# EAGLE design obimon_0.2 (EAGLE 8.3.2)
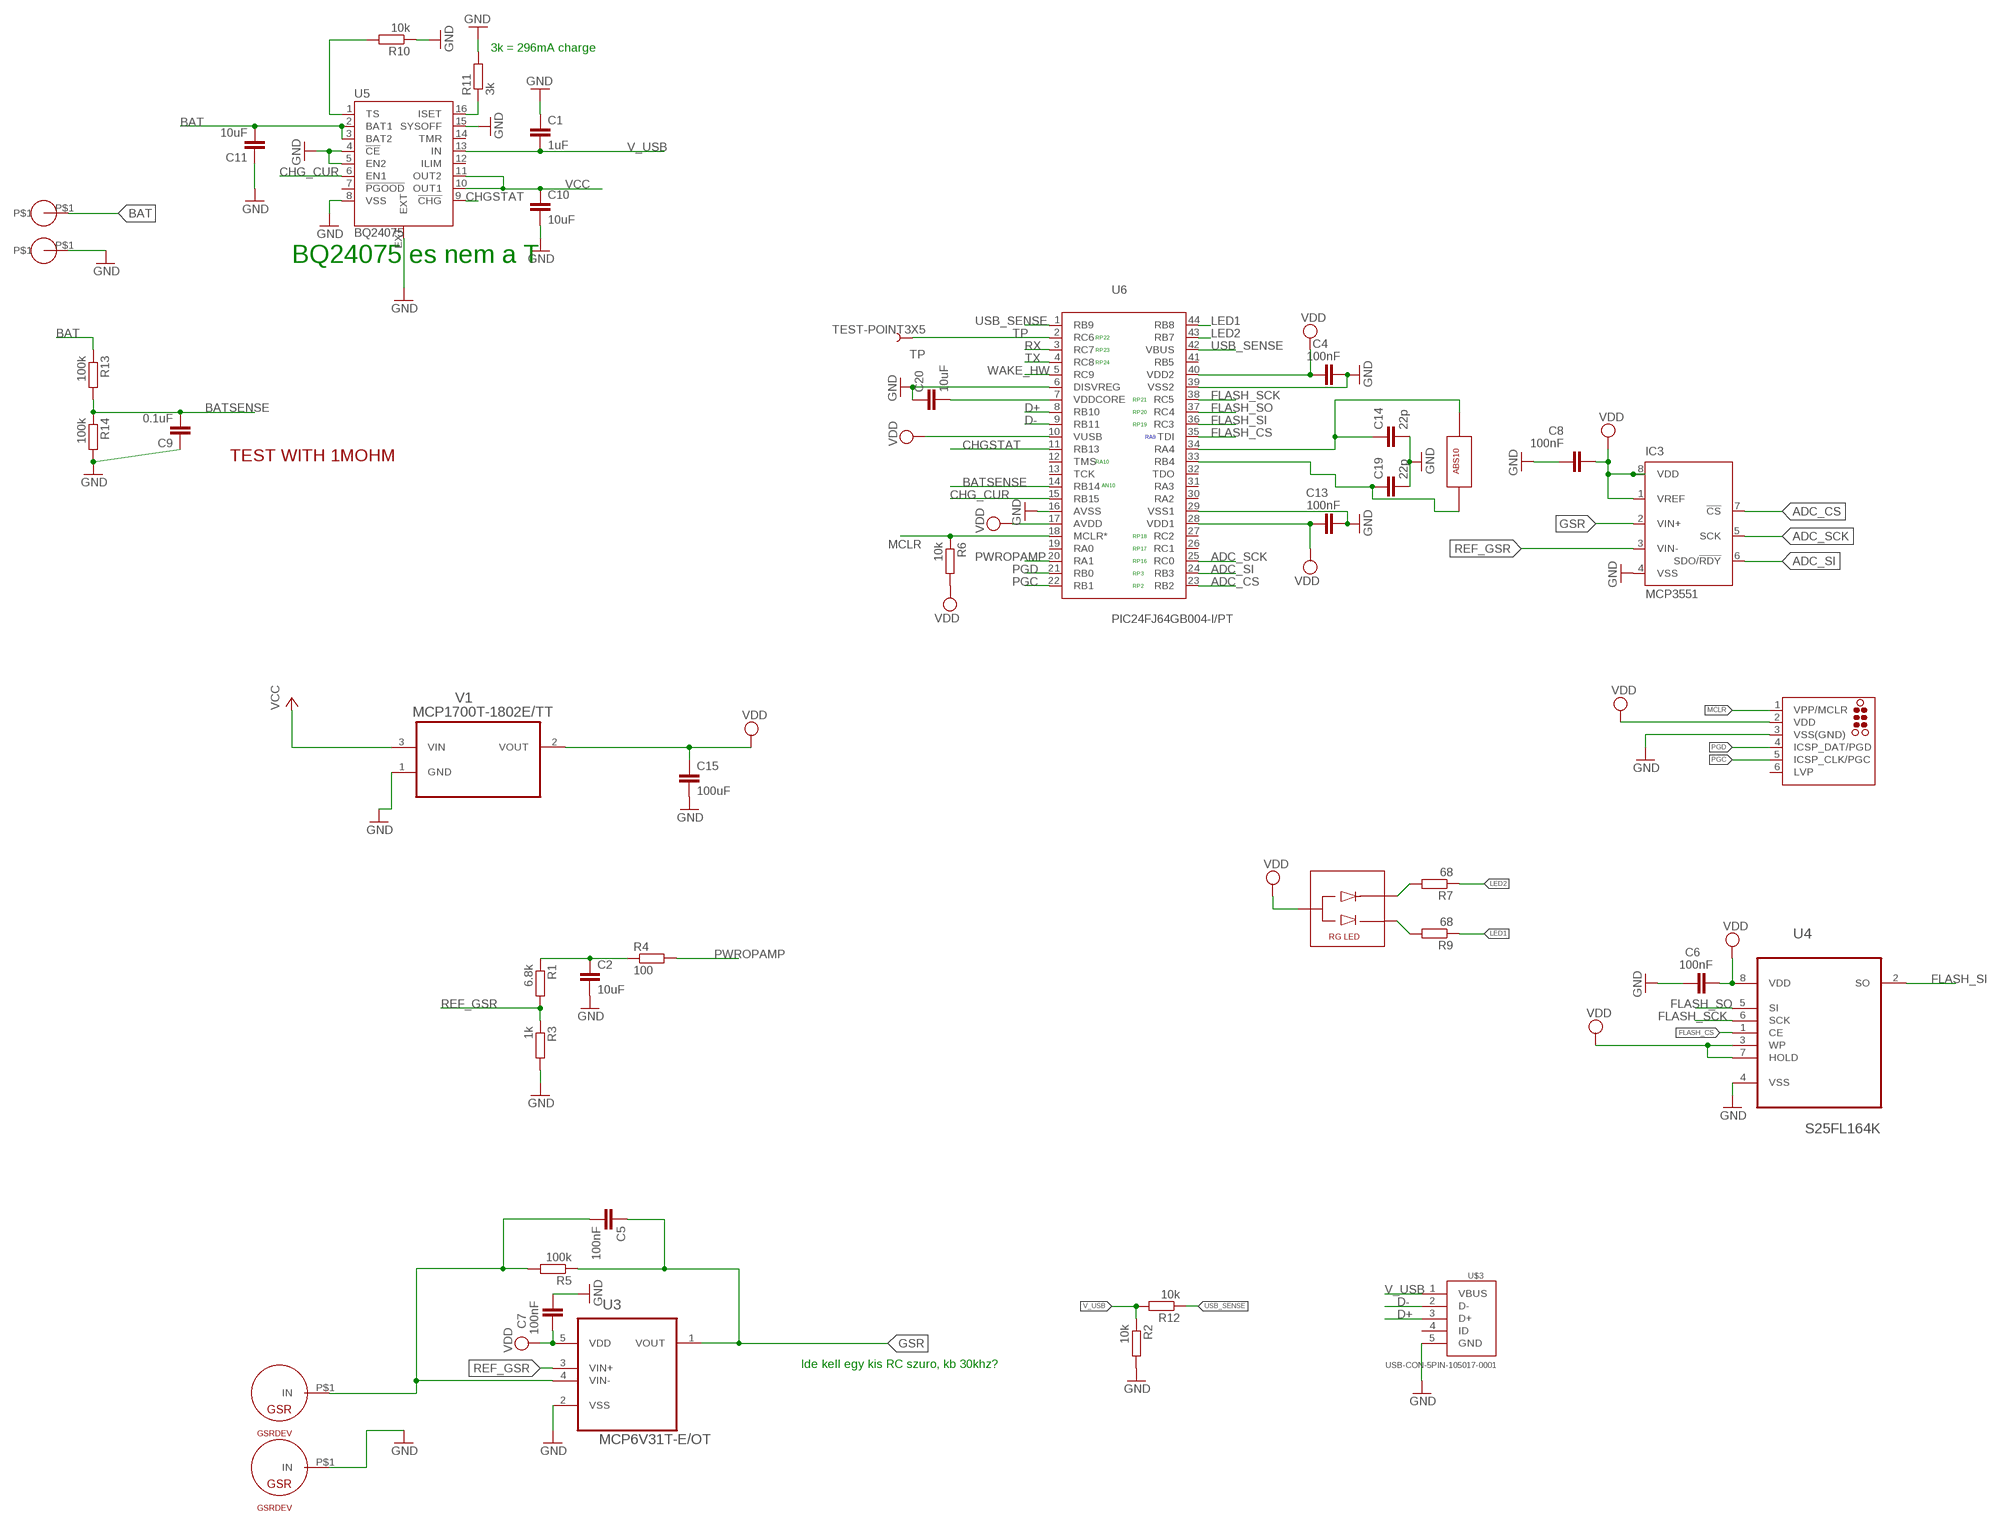
[diagram p0: schematic, sheet 1, part 1 of 2]
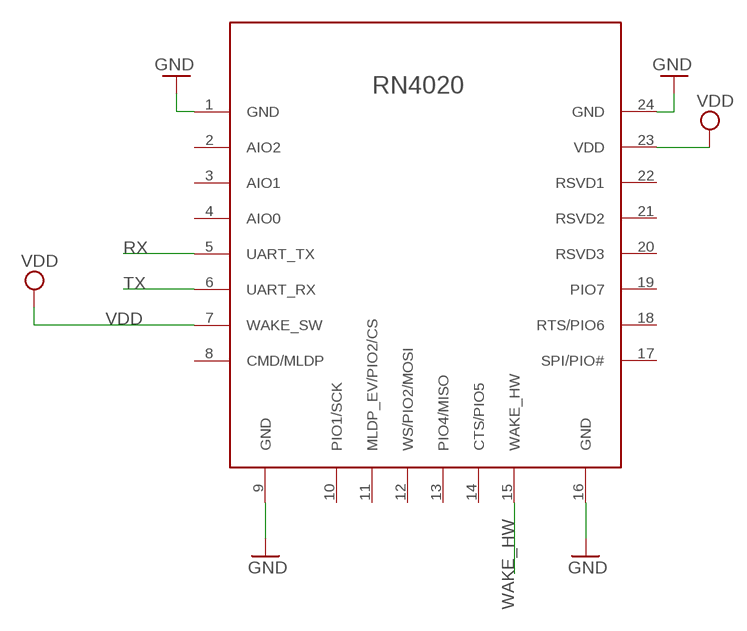
[diagram p1: schematic, sheet 1, part 2 of 2]

## Parts
C1  1uF  C-EUC0805  [C0805]
C2  10uF  C-EUC0805  [C0805]
C4  100nF  C-EUC0805  [C0805]
C5  100nF  C-EUC0805  [C0805]
C6  100nF  C-EUC0805  [C0805]
C7  100nF  C-EUC0805  [C0805]
C8  100nF  C-EUC0805  [C0805]
C9  0.1uF  C-EUC0805  [C0805]
C10  10uF  C-EUC0805  [C0805]
C11  10uF  C-EUC0805  [C0805]
C13  100nF  C-EUC0805  [C0805]
C14  22p  C-EUC0805  [C0805]
C15  100uF  CAP1206  [1206]
C19  22p  C-EUC0805  [C0805]
C20  10uF  C-EUC0805  [C0805]
IC3  MCP3551  MCP3551SN  [SO-08]
J1  TC2030-MCP-NL  [TC2030-MCP-NL]
LED  LED  REDGREENLED  [REDGREENLED]
Q1  ABS10  [ABS10]
R1  6.8k  R-EU_R0805  [R0805]
R2  10k  R-EU_R0805  [R0805]
R3  1k  R-EU_R0805  [R0805]
R4  100  R-EU_R0805  [R0805]
R5  100k  R-EU_R0805  [R0805]
R6  10k  R-EU_M0805  [M0805]
R7  68  R-EU_R0805  [R0805]
R9  68  R-EU_R0805  [R0805]
R10  10k  R-EU_R0805  [R0805]
R11  3k  R-EU_R0805  [R0805]
R12  10k  R-EU_R0805  [R0805]
R13  100k  R-EU_R0805  [R0805]
R14  100k  R-EU_R0805  [R0805]
TP  TEST-POINT3X5  [PAD.03X.05]
U3  MCP6V31T-E/OT  [SOT95P290X145-5N]
U4  S25FL164K  [SOIC127P790X216-8N]
U5  BQ24075  [QFN16_3MM]
U6  PIC24FJ64GB004-I/PT  [QFP80P1200X1200X120-44N]
U$1  GSRDEV  [GSRPAD]
U$2  GSRDEV  [GSRPAD]
U$3  USB-CON-5PIN-105017-0001  [USB-MICRO-MOLEX-105017-0001]
U$6  BATPAD  [BATPAD]
U$7  BATPAD  [BATPAD]
U$8  RN4020  [RN4020]
V1  MCP1700T-1802E/TT  [SOT95P237X112-3N]

## Nets
ADC_CS: IC3.7(!CS) U6.23(RB2)
ADC_SCK: IC3.5(SCK) U6.25(RC0)
ADC_SI: IC3.6(SDO/!RDY) U6.24(RB3)
BAT: C11.2 R13.1 U5.2(BAT1) U5.3(BAT2) U$6.P$1
BATSENSE: C9.2 R13.2 R14.1 U6.14(RB14)
CHG_CUR: U5.6(EN1) U6.15(RB15)
CHGSTAT: U5.9(!CHG) U6.11(RB13)
D+: U6.8(RB10) U$3.3(D+)
D-: U6.9(RB11) U$3.2(D-)
FLASH_CS: U4.1(CE) U6.35(TDI)
FLASH_SCK: U4.6(SCK) U6.38(RC5)
FLASH_SI: U4.2(SO) U6.36(RC3)
FLASH_SO: U4.5(SI) U6.37(RC4)
GND [GND]: C1.1 C2.2 C4.2 C6.1 C7.2 C8.1 C9.1 C10.2 C11.1 C13.2 C14.2 C15.2 C19.2 C20.1 IC3.4(VSS) J1.3(VSS(GND)) R2.2 R3.2 R10.1 R11.2 R14.2 U3.2(VSS) U4.4(VSS) U5.4(!CE) U5.5(EN2) U5.8(VSS) U5.15(SYSOFF) U5.EXT U6.6(DISVREG) U6.16(AVSS) U6.29(VSS1) U6.39(VSS2) U$2.P$1(IN) U$3.5(GND) U$7.P$1 U$8.1(GND) U$8.9(GND) U$8.16(GND) U$8.24(GND) V1.1(GND)
GSR: C5.1 IC3.2(VIN+) R5.1 U3.1(VOUT)
LED1: R9.1 U6.44(RB8)
LED2: R7.1 U6.43(RB7)
MCLR: J1.1(VPP/MCLR) R6.1 U6.18(MCLR*)
N$1: R10.2 U5.1(TS)
N$2: LED.P$3 R7.2
N$3: LED.P$1 R9.2
N$4: R11.1 U5.16(ISET)
N$5: C19.1 Q1.P$1 U6.33(RB4)
N$7: C2.1 R1.1 R4.1
N$10: C5.2 R5.2 U3.4(VIN-) U$1.P$1(IN)
N$11: C14.1 Q1.P$2 U6.34(RA4)
N$17: C20.2 U6.7(VDDCORE)
PGC: J1.5(ICSP_CLK/PGC) U6.22(RB1)
PGD: J1.4(ICSP_DAT/PGD) U6.21(RB0)
PWROPAMP [POWER]: R4.2 U6.20(RA1)
REF_GSR: IC3.3(VIN-) R1.2 R3.1 U3.3(VIN+)
RX: U6.3(RC7) U$8.5(UART_TX)
TP: TP.P$1 U6.2(RC6)
TX: U6.4(RC8) U$8.6(UART_RX)
USB_SENSE: R12.1 U6.1(RB9) U6.42(VBUS)
V_USB [POWER]: C1.2 R2.1 R12.2 U5.13(IN) U$3.1(VBUS)
VCC [POWER]: C10.1 U5.10(OUT1) U5.11(OUT2) V1.3(VIN)
VDD: C4.1 C6.2 C7.1 C8.2 C13.1 C15.1 IC3.1(VREF) IC3.8(VDD) J1.2(VDD) LED.P$2 R6.2 U3.5(VDD) U4.3(WP) U4.7(HOLD) U4.8(VDD) U6.10(VUSB) U6.17(AVDD) U6.28(VDD1) U6.40(VDD2) U$8.7(WAKE_SW) U$8.23(VDD) V1.2(VOUT)
WAKE_HW: U6.5(RC9) U$8.15(WAKE_HW)
Unconnected: J1.6(LVP) U5.7(!PGOOD) U5.12(ILIM) U5.14(TMR) U6.12(TMS) U6.13(TCK) U6.19(RA0) U6.26(RC1) U6.27(RC2) U6.30(RA2) U6.31(RA3) U6.32(TDO) U6.41(RB5) U$3.4(ID) U$8.2(AIO2) U$8.3(AIO1) U$8.4(AIO0) U$8.8(CMD/MLDP) U$8.10(PIO1/SCK) U$8.11(MLDP_EV/PIO2/CS) U$8.12(WS/PIO2/MOSI) U$8.13(PIO4/MISO) U$8.14(CTS/PIO5) U$8.17(SPI/PIO#) U$8.18(RTS/PIO6) U$8.19(PIO7) U$8.20(RSVD3) U$8.21(RSVD2) U$8.22(RSVD1)

## Notes on the sheet
- 3k = 296mA charge
- BQ24075 es nem a T
- RP22
- RP23
- RP24
- RP21
- RP20
- RP19
- RA9
- TEST WITH 1MOHM
- RA10
- AN10
- RP18
- RP17
- RP16
- RP3
- RP2
- Ide kell egy kis RC szuro, kb 30khz?

## Library data of the parts
C1 C2 C4-C11 C13 C14 C19 C20 = rcl:C-EU: CAPACITOR, European symbol
C15 = SparkFun-Capacitors:CAP: Capacitor Standard 0603 ceramic capacitor, and 0.1" leaded capacitor.
IC3 = obimon_0.2:MCP355*: Low-Power, Single-Channel 22-Bit Delta-Sigma ADCs Source: http://ww1.microchip.com/downloads/en/DeviceDoc/21950c.pdf; MPN: MCP3551-E/SN; OC_FARNELL: 1084625; OC_NEWARK: 97K4494
J1 = tag-connect:TC2030: TAG-CONNECT ICSP Connector Manufacturer: Tag-Connect <http://www.tag-connect.com> Cable for easy In-Circuit Serial Programming. Designed for Microchip ICD2, suitable for many others. Two variants - one "with legs" (for hands-free fit on PCB) and another "without legs" for quick programming. PAD Description 1 MCLR/Vpp 2 Vdd 3 GND 4 PGD (ISPDAT) 5 PGC (ISPCLK) 6 nc (used for LVP) ©2009 ROFA.cz - modified and updated by Robert Darlington ‹rdarlington@gmail.com›
LED = obimon:REDGREENLED
Q1 = obimon:ABS10
R1-R7 R9-R14 = resistor:R-EU_: RESISTOR, European symbol
TP = SparkFun-Passives:TEST-POINT: Bare copper test points for troubleshooting or ICT
U3 = mcp6v31:MCP6V31T-E/OT: OP AMP, RRIO, 5.5VIN, 300KHZ, 5SOT23; MPN: MCP6V31T-E/OT; OC_FARNELL: 2113883; OC_NEWARK: 95T9283; PACKAGE: SOT23-5; SUPPLIER: Microchip
U4 = obimon_0.2:S25FL164K: 4 Mbit SPI Serial Flash; MPN: S25FL164K; OC_NEWARK: -; PACKAGE: SOIC-8; SUPPLIER: SILICON STORAGE TECHNOLOGY
U5 = obimon_0.2:BQ24075
U6 = Microchip-PIC24:PIC24FJ64GB004-I/PT: IC MCU 16BIT 64KB FLASH,TQFP-44; MPN: PIC24FJ64GB004-I/PT; OC_FARNELL: 1778487; OC_NEWARK: 45P4827; PACKAGE: TQFP-44; SUPPLIER: Microchip
U$1 U$2 = andras:GSRDEV
U$3 = GeekAmmo:USB-CON-5PIN: Molex Micro USB 105017-0001
U$6 U$7 = obimon:BATPAD
U$8 = microchip2:RN4020
V1 = mcp1700:MCP1700T-1802E/TT: Low Quiescent Current LDO; MPN: MCP1700T-1802E/TT; OC_FARNELL: 1296591; OC_NEWARK: 84R5175; PACKAGE: SOT23-3; SUPPLIER: Microchip

## Net classes
1 GND: width 0.254 mm
2 POWER: width 0.356 mm

## Board
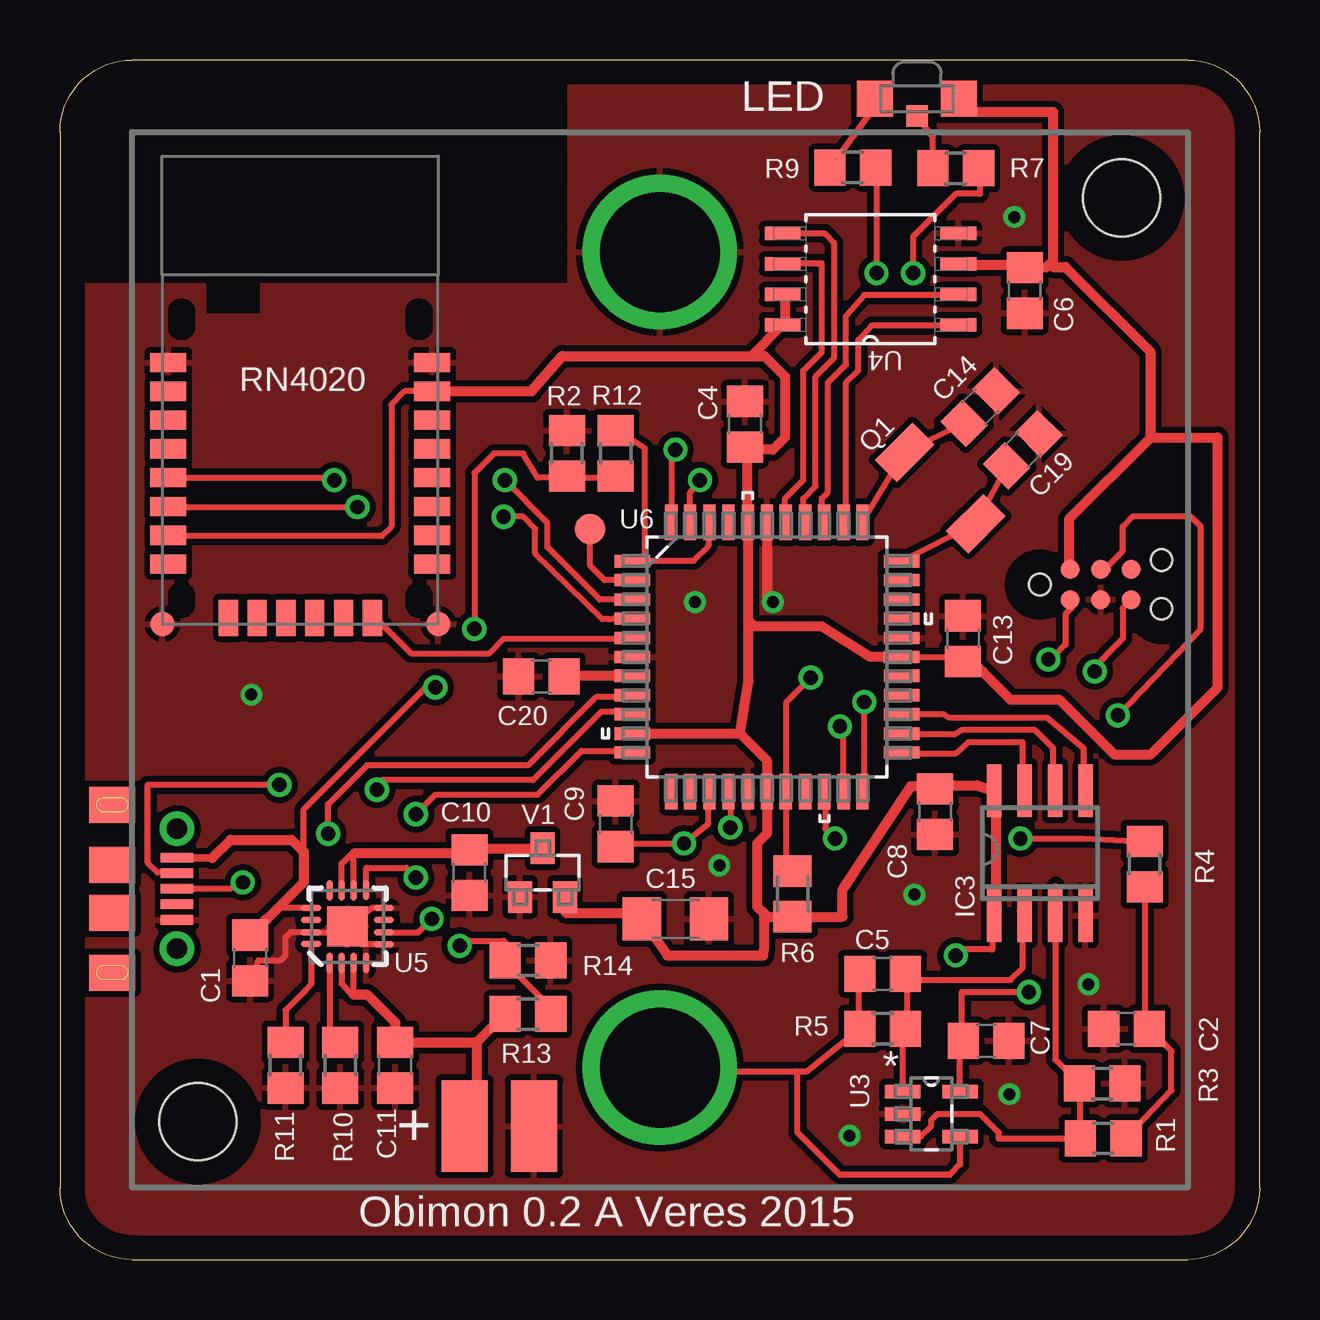
[diagram p2: board, top side]
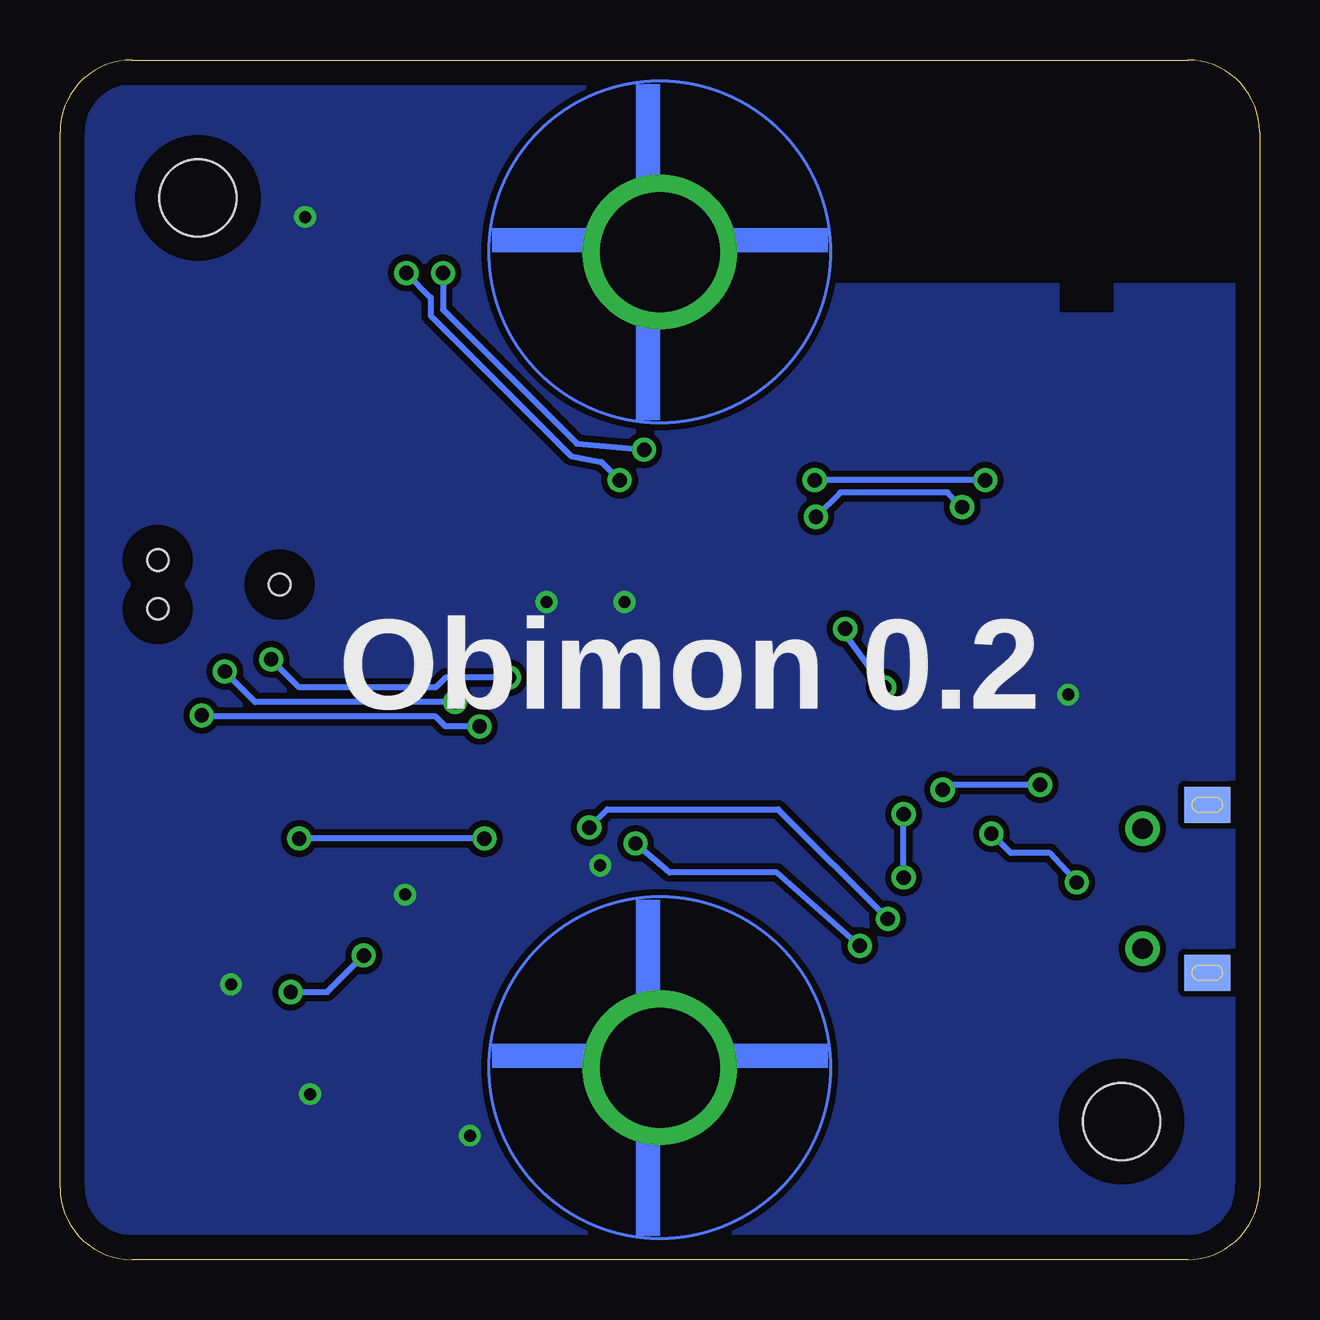
[diagram p3: board, bottom side, seen from below]

Size 50 x 50 mm. Coordinates in mm from the lower left corner, seen from the top.
Outline: 3,0 47,0 arc90 50,3 50,47 arc90 47,50 3,50 arc90 0,47 0,3 arc90 3,0
Copper layers (1*16): Top 0.035mm / dielectric 1.5mm / Bottom 0.035mm
Design rules "default *": minimum track width 10mil, minimum drill 0.6mm, track to track 10mil, track to pad 10mil, pad to pad 10mil, via to via 10mil, smd to smd 10mil, copper to edge 40mil, drill to drill 10mil, minimum pad ring 10mil, minimum via ring 8mil, stop-mask expansion 4mil, vias tented up to drill 30mil, thermal gap 10mil
Holes 3.2 mm at 5.75,5.75 44.25,44.25
tRestrict: area 1,40.7 to 21.1,49
bRestrict: area 1,40.7 to 20.9,49; area 6.1,39.5 to 8.3,41.1

### Footprints (pad centres in the part's own frame; a part is rotated, then mirrored left to right if it is on the bottom)
C0805 = smd 1.3 x 1.5: 1 -0.95,0; 2 0.95,0
1206 = smd 1.6 x 1.8: 1 -1.4,0; 2 1.4,0
SO-08 = smd 0.6 x 2.2: 1 -1.905,-2.6; 2 -0.635,-2.6; 3 0.635,-2.6; 4 1.905,-2.6; 5 1.905,2.6; 6 0.635,2.6; 7 -0.635,2.6; 8 -1.905,2.6
TC2030-MCP-NL = smd 0.787 x 0.787: 1 1.27,-0.635; 2 1.27,0.635; 3 2.54,-0.635; 4 2.54,0.635; 5 3.81,-0.635; 6 3.81,0.635 | hole 0.889: 0,0; 5.08,-1.016; 5.08,1.016
REDGREENLED = smd 1.5 x 1.5: P$1 4.25,0.75; P$2 0.75,0.75 | smd 0.9 x 0.9: P$3 2.5,1.46
ABS10 = smd 1.3 x 2.2: P$1 0.8,1.2; P$2 5,1.2
R0805 = smd 1.3 x 1.5: 1 -0.95,0; 2 0.95,0
M0805 = smd 1.3 x 1.6: 1 -0.95,0; 2 0.95,0
PAD.03X.05 = smd 1.27 x 1.27: P$1 0,0
SOT95P290X145-5N = smd 1.473 x 0.559: 1 -1.194,0.94; 2 -1.194,0; 3 -1.194,-0.94; 4 1.194,-0.94; 5 1.194,0.94
SOIC127P790X216-8N = smd 1.499 x 0.559: 1 -3.658,1.905; 2 -3.658,0.635; 3 -3.658,-0.635; 4 -3.658,-1.905; 5 3.658,-1.905; 6 3.658,-0.635; 7 3.658,0.635; 8 3.658,1.905
QFN16_3MM = smd 0.85 x 0.28: 1 -1.524,0.75; 2 -1.524,0.253; 3 -1.529,-0.25; 4 -1.527,-0.774; 9 1.503,-0.77; 10 1.498,-0.245; 11 1.498,0.255; 12 1.495,0.755 | smd 0.28 x 0.85: 5 -0.765,-1.513; 6 -0.265,-1.513; 7 0.263,-1.513; 8 0.763,-1.513; 13 0.758,1.518; 14 0.258,1.518; 15 -0.247,1.518; 16 -0.742,1.518 | smd 1.68 x 1.68: EXT -0.009,0.008
QFP80P1200X1200X120-44N = smd 1.473 x 0.508: 1 -5.613,3.988; 2 -5.613,3.2; 3 -5.613,2.388; 4 -5.613,1.6; 5 -5.613,0.787; 6 -5.613,0; 7 -5.613,-0.787; 8 -5.613,-1.6; 9 -5.613,-2.388; 10 -5.613,-3.2; 11 -5.613,-3.988; 23 5.613,-3.988; 24 5.613,-3.2; 25 5.613,-2.388; 26 5.613,-1.6; 27 5.613,-0.787; 28 5.613,0; 29 5.613,0.787; 30 5.613,1.6; 31 5.613,2.388; 32 5.613,3.2; 33 5.613,3.988 | smd 0.508 x 1.473: 12 -3.988,-5.613; 13 -3.2,-5.613; 14 -2.388,-5.613; 15 -1.6,-5.613; 16 -0.787,-5.613; 17 0,-5.613; 18 0.787,-5.613; 19 1.6,-5.613; 20 2.388,-5.613; 21 3.2,-5.613; 22 3.988,-5.613; 34 3.988,5.613; 35 3.2,5.613; 36 2.388,5.613; 37 1.6,5.613; 38 0.787,5.613; 39 0,5.613; 40 -0.787,5.613; 41 -1.6,5.613; 42 -2.388,5.613; 43 -3.2,5.613; 44 -3.988,5.613
GSRPAD = drill 5 pad 6.452: P$1 0,0
USB-MICRO-MOLEX-105017-0001 = smd 0.4 x 1.35: 1 1.2,0; 2 1.85,0; 3 2.5,0; 4 3.15,0; 5 3.8,0 | drill 0.85 pad 1.45: P$1 0,0; P$2 5,0 | smd 1.5 x 1.9: P$3 3.5,-2.7; P$4 1.5,-2.7; P$5 -1,-2.7; P$6 6,-2.7 | smd 1.5 x 1.9 bottom: P$7 -1,-2.7; P$8 6,-2.7
BATPAD = smd 3.81 x 1.93: P$1 0,0
RN4020 = smd 1.5 x 0.8: 1 0.25,10.9; 2 0.25,9.7; 3 0.25,8.5; 4 0.25,7.3; 5 0.25,6.1; 6 0.25,4.9; 7 0.25,3.7; 8 0.25,2.5; 17 11.25,2.5; 18 11.25,3.7; 19 11.25,4.9; 20 11.25,6.1; 21 11.25,7.3; 22 11.25,8.5; 23 11.25,9.7; 24 11.25,10.9 | smd 1 x 1: 9 0,0; 16 11.5,0 | smd 0.8 x 1.5: 10 2.75,0.25; 11 3.95,0.25; 12 5.15,0.25; 13 6.35,0.25; 14 7.55,0.25; 15 8.75,0.25
SOT95P237X112-3N = smd 0.991 x 1.321: 1 -0.94,-1.016; 2 0.94,-1.016; 3 0,1.016

### Placement (x,y rotation side)
C1  7.92,12.57 90 top
C2  44.45,9.62 180 top
C4  28.55,34.82 90 top
C5  34.29,11.91 180 top
C6  40.21,40.39 90 top
C7  38.61,9.12 0 top
C8  36.47,18.67 90 top
C9  23.16,18.16 270 top
C10  17.07,16.13 270 top
C11  13.97,8.1 90 top
C13  37.64,25.88 90 top
C14  38.35,35.53 45 top
C15  25.65,14.2 0 top
C19  40.13,33.75 45 top
C20  20.07,24.31 0 top
IC3  40.84,16.94 0 top
J1  40.84,28.14 0 top
LED  38.23,49.13 180 top
Q1  39.59,30.96 135 top
R1  43.48,5.05 180 top
R2  21.13,33.6 90 top
R3  43.43,7.34 0 top
R4  45.21,16.48 90 top
R5  34.29,9.62 180 top
R6  30.53,15.24 270 top
R7  37.34,45.49 180 top
R9  33.05,45.52 180 top
R10  11.68,8.1 90 top
R11  9.4,8.1 270 top
R12  23.16,33.6 270 top
R13  19.51,10.23 0 top
R14  19.51,12.47 0 top
TP  22.1,30.45 0 top
U3  36.32,6.07 0 top
U4  33.78,40.87 180 top
U5  11.99,13.89 90 top
U6  29.46,25.12 0 top
U$1  25,8 0 top
U$2  25,42 0 top
U$3  4.88,17.96 270 top
U$6  16.87,5.56 270 top
U$7  19.76,5.56 270 top
U$8  4.27,26.49 0 top
V1  20.12,16.13 0 top

### Tracks (layer width: path | path; a pad name or v marks a point on that pad's centre or on a via)
ADC_CS
  Top 0.254: 40.13,20.55 40.13,19.63 IC3.7 40.13,20.55 | U6.23 35.31,21.1 37.34,21.1 37.85,21.56 40.13,21.56 40.13,20.55
ADC_SCK
  Top 0.254: 35.15,22.83 U6.25 35.31,22.73 36.83,22.73 37.08,22.58 41.15,22.58 42.67,21.31 42.67,19.78 IC3.5
ADC_SI
  Top 0.254: 41.4,19.63 IC3.6 41.4,19.78 41.4,21.31 40.64,22.07 37.59,22.07 37.34,21.92 35.31,21.92 U6.24 35.15,22.02
BAT
  Top 0.254: U5.3 12.24,11.05 12.19,11 11.74,11.5 U5.2
  Top 0.406: 12.24,11.05 12.8,11.05 13.97,9.88 C11.2 17.37,9.05 | 17.37,9.05 R13.1 | 17.37,9.05 17.37,6.07 U$6.P$1
BATSENSE  (via drill 0.6)
  Top 0.254: U6.14 27.03,19.38 27.03,18.16 v26.01,17.35 23.16,17.35 C9.2 | 18.69,12.47 18.69,13.08 18.49,13.28 17.07,13.28 v16.66,13.08 | 18.69,12.47 18.69,12.27 20.32,10.64 20.32,10.44 20.52,10.23 R13.2 20.88,10.23 | 18.69,12.47 R14.1
  Bottom 0.254: v26.01,17.35 24.59,16.13 20.12,16.13 v16.66,13.08
CHG_CUR  (via drill 0.6)
  Top 0.254: v27.94,18.01 27.94,19.28 U6.15 | U5.6 14.92,13.63 v15.49,14.2
  Bottom 0.254: v15.49,14.2 20.07,18.77 27.18,18.77 v27.94,18.01
CHGSTAT  (via drill 0.6)
  Top 0.254: v14.83,15.92 14.43,16.33 12.8,16.33 12.76,16.29 U5.9 | v14.83,18.56 15.65,19.38 19.91,19.38 21.74,21.21 23.77,21.21 U6.11
  Bottom 0.254: v14.83,15.92 v14.83,18.56
D+  (via drill 0.6)
  Top 0.254: v7.62,15.72 7.11,15.47 U$3.3 | U6.8 23.77,23.44 22.35,23.44 19.51,20.6 12.8,20.6 11.18,18.97 v11.18,17.75
  Bottom 0.254: v11.18,17.75 10.36,16.94 8.74,16.94 v7.62,15.72
D-  (via drill 0.6)
  Top 0.254: U$3.2 4.88,16.13 4.06,16.13 3.66,16.53 3.66,19.78 v9.14,19.78 | U6.9 23.77,22.83 22.55,22.83 19.71,19.99 13.41,19.99 13.21,19.78 v13.21,19.58
  Bottom 0.254: v13.21,19.58 13.01,19.78 v9.14,19.78
FLASH_CS
  Top 0.254: U6.35 32.77,30.96 32.77,36.55 33.27,37.06 33.27,38.33 33.83,38.93 37.39,38.93 U4.1
FLASH_SCK
  Top 0.254: U6.38 30.23,30.96 30.23,31.72 30.99,32.48 30.99,37.06 31.75,37.82 31.75,41.52 30.23,41.52 U4.6
FLASH_SI
  Top 0.254: U6.36 31.75,30.96 31.75,31.72 32,31.98 32,36.55 32.77,37.31 32.77,39.34 33.53,40.2 37.34,40.2 U4.2
FLASH_SO
  Top 0.254: U6.37 30.99,30.96 30.99,31.72 31.5,32.23 31.5,36.8 32.26,37.56 32.26,42.39 31.88,42.77 U4.5
GND  (via drill 0.5)
  Top 0.254: U5.EXT 12.39,13.89 12.6,13.69 12.6,13.13 13.41,13.13 U5.5 | U5.EXT 11.98,13.64 U5.15 9.61,13.64 9.4,13.43 9.4,12.67 9.2,12.47 8.27,12.47 C1.1 | U5.8 13.01,14.65 U5.EXT
  Top 0.406: v29.72,27.4 29.46,27.66 U6.39
  other vias: 32.92,5.17 35.61,15.21 27.48,16.43 26.47,27.4 42.87,11.46 7.98,23.54 39.78,43.46 39.57,6.89
  pour Top: 0,50.01 50.04,50.01 50.04,-0.03 0,-0.03
  pour Bottom: 0,50.01 50.04,50.01 50.04,-0.03 0,-0.03
GSR
  Top 0.254: 40,14.53 IC3.2 40.13,14.26 40.13,12.16 39.62,11.66 35.31,11.66 | U3.1 35.13,9.51 R5.1 35.31,9.62 35.31,11.66 | 35.31,11.66 C5.1
LED1  (via drill 0.6)
  Top 0.254: v25.65,33.75 25.5,33.4 25.5,31.11 U6.44 | v34.04,41.12 34.04,45.44 R9.1
  Bottom 0.254: v25.65,33.75 28.45,34.01 34.04,39.6 v34.04,41.12
LED2  (via drill 0.6)
  Top 0.254: U6.43 26.26,30.96 26.26,31.98 v26.67,32.48 | v35.56,41.12 35.56,42.64 37.34,44.42 38.35,44.42 38.35,45.44 R7.1
  Bottom 0.254: v26.67,32.48 27.43,33.25 28.7,33.5 34.54,39.34 34.54,40.1 v35.56,41.12
MCLR  (via drill 0.6)
  Top 0.254: R6.1 30.25,16.22 U6.18 30.28,19.58 30.28,23.24 v31.29,24.25 | 42.06,27.1 42.27,27.3 J1.1 42.16,27.15 41.91,26.9 41.91,25.63 41.4,25.12 v41.2,25.02
  Bottom 0.254: v41.2,25.02 40.03,23.85 34.34,23.85 33.93,24.25 v31.29,24.25
N$1
  Top 0.254: U5.1 11.24,9.49 R10.2
N$2
  Top 0.254: 35.8,47.6 LED.P$3 36.37,46.81 R7.2 36.37,44.98
N$3
  Top 0.254: 34.3,48.4 34,48.4 LED.P$1 | 33.93,48.03 LED.P$1 | R9.2 34.12,48.24 LED.P$1
N$4
  Top 0.254: U5.16 10.47,11.47 10.23,11.22 9.4,10.39 R11.1
N$5
  Top 0.254: U6.33 Q1.P$1 C19.1
N$7
  Top 0.254: R1.1 46.33,7.05 46.33,8.69 C2.1 45.21,9.81 R4.1
N$10
  Top 0.254: U$1.P$1 25.15,7.85 30.73,7.85 | 30.73,7.85 31.14,7.85 R5.2 33.27,9.62 33.27,11.66 C5.2 | U3.4 37.52,3.96 37.08,3.53 32.51,3.53 30.73,5.31 30.73,7.85
N$11
  Top 0.254: U6.34 Q1.P$2 C14.1
N$17
  Top 0.406: U6.7 20.57,24.33 C20.2
PGC  (via drill 0.6)
  Top 0.254: v33.53,23.24 33.53,19.58 U6.22 | J1.5 44.3,27.15 44.3,25.88 42.88,24.46 v43.13,24.51
  Bottom 0.254: v43.13,24.51 41.86,23.24 v33.53,23.24
PGD  (via drill 0.6)
  Top 0.254: J1.4 43.48,28.73 43.69,28.73 43.69,28.93 44.3,29.54 44.3,30.55 44.7,30.96 47.14,30.96 47.55,30.55 47.55,26.29 v44.09,22.68 | v32.51,22.22 32.66,22.07 32.66,19.63 U6.21
  Bottom 0.254: 44.25,22.68 v44.09,22.68 44.04,22.63 34.34,22.63 33.93,22.22 v32.51,22.22
PWROPAMP  (via drill 0.6)
  Top 0.254: v32.31,17.55 31.9,17.95 31.9,19.38 U6.20 | 40.03,17.35 v40.03,17.55 42.67,17.55 R4.2
  Bottom 0.254: v32.31,17.55 v40.03,17.55
REF_GSR
  Top 0.254: 41.5,15.56 41.5,14.53 IC3.3 41.49,13.16 41.49,8.34 R3.1 42.03,7.13 42.53,6.63 R1.2 39.12,5.05 39.12,5.31 38.35,6.07 36.58,6.07 36.32,5.81 36.32,5.56 35.89,5.13 U3.3
RX  (via drill 0.6)
  Top 0.254: U$8.5 4.67,32.59 11.33,32.59 v11.43,32.48 | U6.3 22.5,27.51 20.32,29.69 20.32,30.71 v18.54,32.48
  Bottom 0.254: v11.43,32.48 v18.54,32.48
TP
  Top 0.254: U6.2 22.71,28.32 22.1,28.93 TP.P$1
TX  (via drill 0.6)
  Top 0.254: v12.39,31.37 4.67,31.37 U$8.6 | v18.49,30.96 19.3,30.96 19.81,30.45 19.81,29.44 22.61,26.69 22.86,26.69 22.96,26.69 23.77,26.69 U6.4
  Bottom 0.254: v18.49,30.96 17.48,31.98 13.01,31.98 v12.39,31.37
USB_SENSE
  Top 0.254: 24.38,29.13 24.38,33.8 23.16,34.62 R12.1 | 23.77,29.13 U6.1 | 24.38,29.13 23.98,29.13 U6.1 | 24.38,29.13 26.42,29.13 27.03,29.74 27.03,30.55 U6.42 | 24.38,29.13 U6.1
V_USB  (via drill 0.6)
  Top 0.254: 4.88,16.74 U$3.1 | U5.13 10.36,14.65 9.19,14.65 9.14,14.7 | v17.27,26.29 17.27,32.79 18.09,33.6 19.3,33.6 19.91,32.59 21.13,32.59 | 21.13,32.59 23.16,32.59 R12.2 | 21.13,32.59 R2.1 | 10.16,16.99 10.16,18.77 15.24,23.85 v15.65,23.85 | 8.64,14.2 8.6,14.2
  Top 0.305: 4.88,16.74 6.35,16.74
  Top 0.406: 8.64,14.2 9.14,14.7 10.16,15.72 10.16,16.99 9.65,17.5 7.11,17.5 6.35,16.74 | 8.09,13.69 C1.2 8.6,14.2
  Bottom 0.254: v15.65,23.85 17.27,26.08 v17.27,26.29
VCC
  Top 0.254: U5.11 11.74,15.52 11.74,16.49 12.23,16.99 12.23,16.86 | 16.46,16.94 C10.1 | U5.10 12.23,16.86 | 12.23,16.86 12.24,16.87 12.38,16.87 12.3,16.94
  Top 0.406: 12.3,16.94 16.46,16.94 | C10.1 16.98,17.14 V1.3
VDD  (via drill 0.6)
  Top 0.254: C8.2 37.25,19.77 | 30.12,14.3 R6.2 30.07,14.3 | U$8.23 14.37,36.19 13.82,35.63 13.82,30.55 13.41,30.15 4.56,30.15 U$8.7 | 38.81,19.38 IC3.8 | 37.59,48.23 37.8,47.83 | 37.59,48.44 LED.P$2 | 42.27,28.92 J1.2 | 37.91,24.98 C13.1 37.71,25.12 U6.28 | 20.93,15.11 V1.2 | 24.18,14.3 C15.1 | U3.5 37.52,9.48 C7.1 37.59,9.62 37.59,11.15 v40.39,11.15 | IC3.1 38.86,14.2 38.86,12.93 37.34,12.93 v37.34,12.67 | 40.13,41.47 C6.2 | 37.59,41.47 U4.3
  Top 0.406: U6.10 28.35,21.92 | 28.35,21.92 28.7,24.1 28.7,26.64 | 28.7,26.64 28.7,30.71 U6.40 28.65,30.76 28.65,33.77 C4.1 | U6.28 33.78,25.12 31.75,26.39 28.96,26.39 28.7,26.64 | 28.96,33.8 28.64,33.8 C4.1 | 28.35,21.92 29.46,20.8 U6.17 29.46,17.75 29.06,17.35 29.06,14.7 29.36,14.4 | 37.25,19.77 38.24,19.77 IC3.8 39.01,19.38 39.01,14.5 IC3.1 | U$8.23 19.66,36.19 20.93,37.67 28.83,37.67 | 37.59,48.23 37.48,48.23 LED.P$2 | C8.2 36.87,19.73 35.46,19.73 32.62,15.42 32.62,14.29 R6.2 29.47,14.29 29.36,14.4 | 29.36,14.4 29.36,12.98 29.31,12.67 25.32,12.67 C15.1 24.13,14.2 24.13,14.45 21.08,14.45 21.08,14.96 V1.2 | 37.8,47.83 41.4,47.83 41.4,41.63 41.27,41.5 | J1.2 42.06,28.82 42.06,30.86 45.47,34.26 | 28.96,33.8 29.01,33.8 | 28.96,33.8 28.65,33.8 | 28.83,37.67 U4.8 30.23,39.09 30.23,40.1 U4.7 | 28.83,37.67 29.36,37.67 30.23,36.8 30.23,34.26 29.72,33.75 28.67,33.75 C4.1 | 37.91,24.98 37.96,24.98 38.47,24.49 39.62,23.34 41.66,23.34 43.94,21.05 45.47,21.05 48.26,23.85 48.26,34.26 45.47,34.26 | 37.59,41.47 40.08,41.47 C6.2 40.39,41.37 41.15,41.37 41.27,41.5 | 41.27,41.5 41.4,41.37 41.91,41.37 45.47,37.82 45.47,34.26
  Bottom 0.254: v37.34,12.67 38.86,11.15 v40.39,11.15
WAKE_HW
  Top 0.254: U$8.15 13.16,26.74 14.63,25.27 17.88,25.27 18.49,25.88 23.82,25.88 U6.5

### Text on the board
tNames: + | Obimon 0.2 A Veres 2015
bNames: Obimon 0.2